# EAGLE design MySens-nRF52-V01-008 (EAGLE 9.1.0)
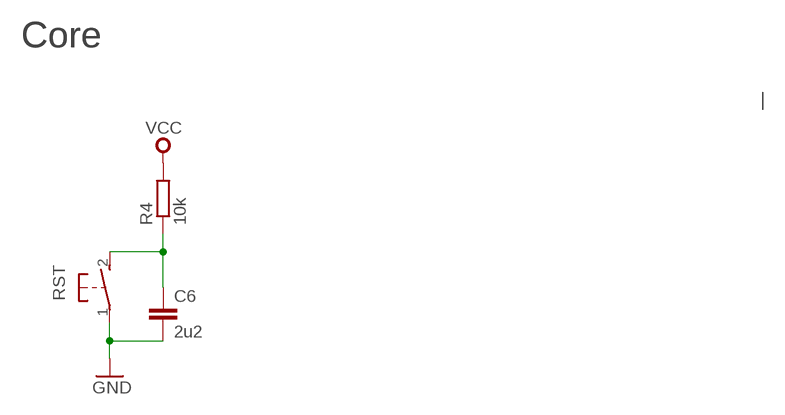
[diagram p0: schematic, sheet 1, part 1 of 2]
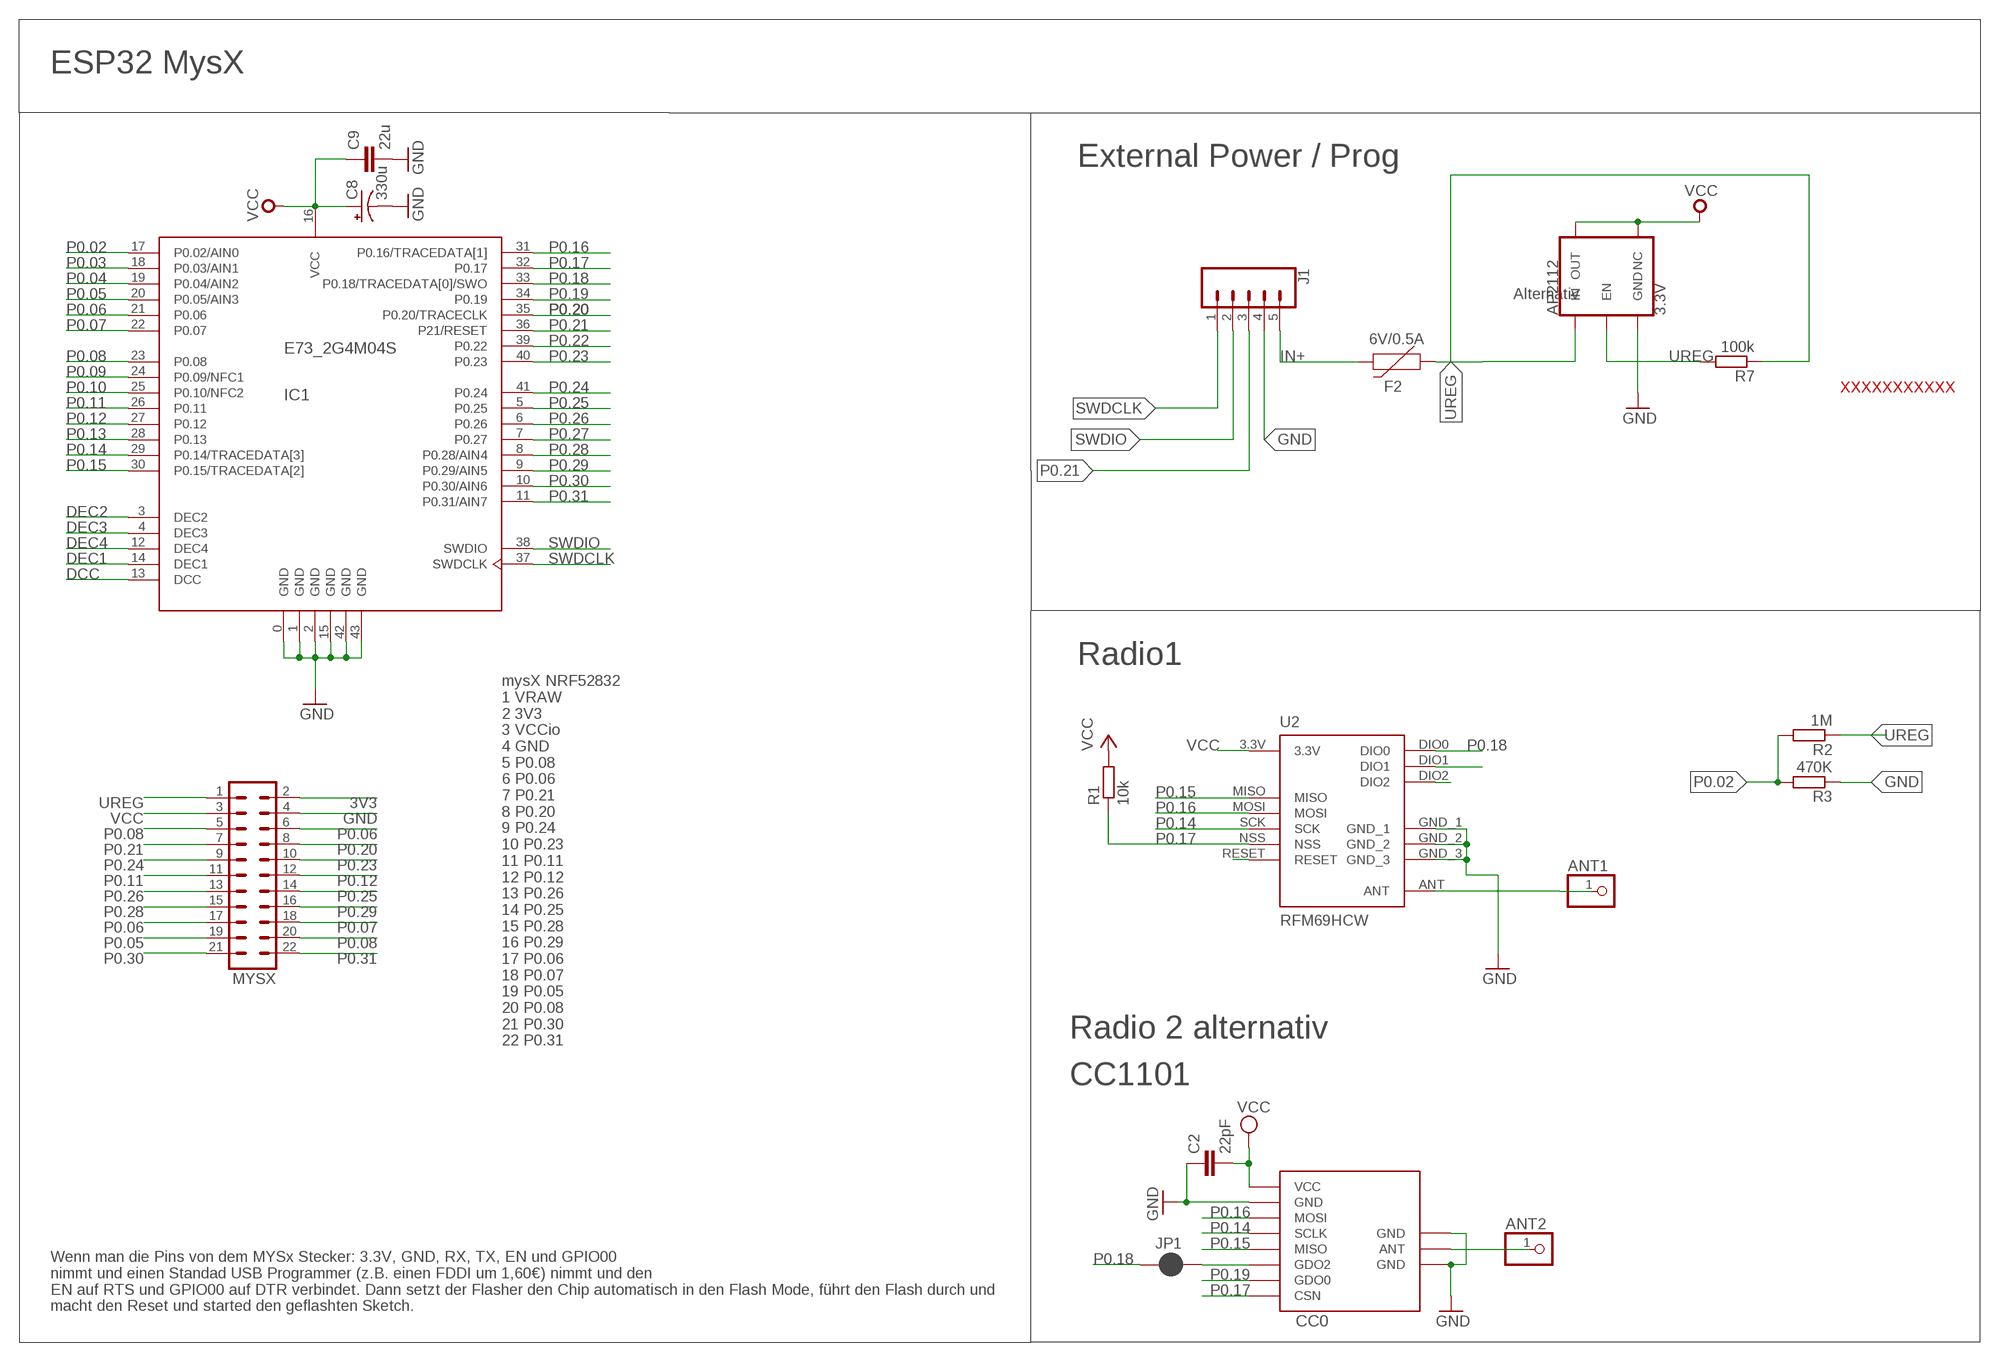
[diagram p1: schematic, sheet 1, part 2 of 2]

## Parts
ANT1  PINHD-1X1  [1X01]
ANT2  PINHD-1X1  [1X01]
AP2112  3.3V  V_REG_AP2112K-3.3V  [SOT23-5]
C2  22pF  C-EUC0805  [C0805]
C6  2u2  C-EUC0805  [C0805]
C8  330u  CAP_POLSMD  [VISHAY_C]
C9  22u  C-EUC0805  [C0805]
CC0  CC1101  CC1101_MODULE1SMD  [CC1101_MODULE1_SMD]
F2  6V/0.5A  PPTC_HALF-AMP  [1206]
IC1  E73_2G4M04S  [E73_2G4M04S]
J1  CONN_05LOCK  [1X05_LOCK]
JP1  JUMPER-SMT_2_NC_PASTE_NO-SILK  [SMT-JUMPER_2_NC_PASTE_NO-SILK]
MYSX  MA11-2  [MA11-2]
R1  10k  R-EU_M0805  [M0805]
R2  1M  R-EU_M0805  [M0805]
R3  470K  R-EU_M0805  [M0805]
R4  10k  R-EU_M0805  [M0805]
R7  100k  R-EU_M0805  [M0805]
RST  DTSM-3  [DTSM-3]
U2  RFM69HCW  [RFM69HCW-XXXS2]

## Nets
3V3: MYSX.2
ANT0: ANT2.1 CC0.ANT
ANT1: ANT1.1 U2.ANT
DCC: IC1.13(DCC)
DEC1: IC1.14(DEC1)
DEC2: IC1.3(DEC2)
DEC3: IC1.4(DEC3)
DEC4: IC1.12(DEC4)
GND [gnd]: AP2112.2(GND) C2.1 C6.2 C8.- C9.2 CC0.GND@0(GND) CC0.GND@1(GND) CC0.GND@2(GND) IC1.0(GND) IC1.1(GND) IC1.2(GND) IC1.15(GND) IC1.42(GND) IC1.43(GND) J1.4 MYSX.4 R3.1 RST.1 U2.GND_1 U2.GND_2 U2.GND_3
IN+ [vcc]: F2.2 J1.5
MAYBE_IO5: CC0.GDO2 JP1.2
N$1: AP2112.3(EN) R7.2
N$2: C6.1 R4.1 RST.2
N$4: U2.DIO2
N$8: U2.DIO1
N$9: U2.RESET
P0.02: IC1.17(P0.02/AIN0) R2.2 R3.2
P0.03: IC1.18(P0.03/AIN1)
P0.04: IC1.19(P0.04/AIN2)
P0.05: IC1.20(P0.05/AIN3) MYSX.19
P0.06: IC1.21(P0.06) MYSX.6 MYSX.17
P0.07: IC1.22(P0.07) MYSX.18
P0.08: IC1.23(P0.08) MYSX.5 MYSX.20
P0.09: IC1.24(P0.09/NFC1)
P0.10: IC1.25(P0.10/NFC2)
P0.11: IC1.26(P0.11) MYSX.11
P0.12: IC1.27(P0.12) MYSX.12
P0.13: IC1.28(P0.13)
P0.14: CC0.SCLK IC1.29(P0.14/TRACEDATA[3]) U2.SCK
P0.15: CC0.MISO IC1.30(P0.15/TRACEDATA[2]) U2.MISO
P0.16: CC0.MOSI IC1.31(P0.16/TRACEDATA[1]) U2.MOSI
P0.17: CC0.CSN IC1.32(P0.17) R1.1 U2.NSS
P0.18: IC1.33(P0.18/TRACEDATA[0]/SWO) JP1.1 U2.DIO0
P0.19: CC0.GDO0 IC1.34(P0.19)
P0.20: IC1.35(P0.20/TRACECLK) MYSX.8
P0.21: IC1.36(P21/RESET) J1.3 MYSX.7
P0.22: IC1.39(P0.22)
P0.23: IC1.40(P0.23) MYSX.10
P0.24: IC1.41(P0.24) MYSX.9
P0.25: IC1.5(P0.25) MYSX.14
P0.26: IC1.6(P0.26) MYSX.13
P0.27: IC1.7(P0.27)
P0.28: IC1.8(P0.28/AIN4) MYSX.15
P0.29: IC1.9(P0.29/AIN5) MYSX.16
P0.30: IC1.10(P0.30/AIN6) MYSX.21
P0.31: IC1.11(P0.31/AIN7) MYSX.22
SWDCLK: IC1.37(SWDCLK) J1.1
SWDIO: IC1.38(SWDIO) J1.2
UREG [gnd]: AP2112.1(IN) F2.1 MYSX.1 R2.1 R7.1
VCC [gnd]: AP2112.4(NC) AP2112.5(OUT) C2.2 C8.+ C9.1 CC0.VCC IC1.16(VCC) MYSX.3 R1.2 R4.2 U2.3.3V

## Notes on the sheet
- Core | Core
- ESP32 MysX
- External Power / Prog
- Alternativ
- XXXXXXXXXXX
- Radio1
- Radio 2 alternativ
- mysX NRF52832
  1 VRAW
  2 3V3
  3 VCCio
  4 GND
  5 P0.08
  6 P0.06
  7 P0.21
  8 P0.20
  9 P0.24
  10 P0.23
  11 P0.11
  12 P0.12
  13 P0.26
  14 P0.25
  15 P0.28
  16 P0.29
  17 P0.06
  18 P0.07
  19 P0.05
  20 P0.08
  21 P0.30
  22 P0.31
- CC1101
- Wenn man die Pins von dem MYSx Stecker: 3.3V, GND, RX, TX, EN und GPIO00
  nimmt und einen Standad USB Programmer (z.B. einen FDDI um 1,60€) nimmt und den
  EN auf RTS und GPIO00 auf DTR verbindet. Dann setzt der Flasher den Chip automatisch in den Flash Mode, führt den Flash durch und
  macht den Reset und started den geflashten Sketch.

## Library data of the parts
ANT1 ANT2 = pinhead:PINHD-1X1: PIN HEADER
AP2112 = SparkFun-IC-Power:V_REG_AP2112: AP2112 - 600mA CMOS LDO Regulator w/ Enable The AP2112 is CMOS process low dropout linear regulator with enable function, the regulator delivers a guaranteed 600mA (min.) continuous load current. Features Output Voltage Accuracy: ±1.5% Output Current: 600mA (Min.) Foldback Short Current Protection: 50mA Enable Function to Turn ON/OFF VOUT Low Dropout Voltage (3.3V): 250mV (Typ.) @IOUT=600mA Excellent Load Regulation: 0.2%/A (Typ.) Excellent Line Regulation: 0.02%/V (Typ.) Low Quiescent Current: 55μA (Typ.) Low Standby Current: 0.01μA (Typ.) Low Output Noise: 50μVRMS PSRR: 100Hz -65dB, 1kHz -65dB OTSD Protection Stable with 1.0μF Flexible Cap: Ceramic, Tantalum and Aluminum Electrolytic Operation Temperature Range: -40°C to 85°C ESD: MM 400V, HBM 4000V; PROD_ID: VREG-12457
C2 = rcl:C-EU: CAPACITOR, European symbol; SPICEPREFIX: C
C6 C9 = rcl@1:C-EU: CAPACITOR, European symbol; SPICEPREFIX: C
C8 = SparkFun-Passives:CAP_POL: Capacitor Polarized These are standard SMD and PTH capacitors. Normally 10uF, 47uF, and 100uF in electrolytic and tantalum varieties. Always verify the external diameter of the through hole cap, it varies with capacity, voltage, and manufacturer. The EIA devices should be standard.
CC0 = wireless:CC1101_MODULE1: CC1101 wireless module for 433/868 MHz (sold from Aliexpress). DIL version for mounting with pin header (and SMD soldering) and SMD only variant available.
F2 = SparkFun-Fuses:PPTC: Resettable Fuse PPTC Resettable Fuse. Really a sort of resistor with a polymeric positive temperature coefficient whose resistance increases dramatically with an increase in temperature. When heated by the power passing through the resistance rises causing the current to be limited, protecting the circuit. This is achieved by the transition of the polymer from a crystalline to an amorphous state where the conductive carbon separates breaking the conductive pathways found in the cool crystalline structure. When a PPTC cools back down it resumes conducting letting the circuit turn back on. SparkFun Products: SparkFun RedBoard - Programmed with Arduino <https://www.sparkfun.com/products/12757> Pro Micro - 5V/16MHz <https://www.sparkfun.com/products/12640> Arduino Pro 328 - 5V/16MHz <https://www.sparkfun.com/products/10915> MP3 Trigger <https://www.sparkfun.com/products/13720>; PROD_ID: RES-08585
IC1 = E73-2G4M04S:E73_2G4M04S: E73-2G4M04S nRF52832 based BLE module
J1 = SparkFun-Connectors:CONN_05: Multi connection point. Often used as Generic Header-pin footprint for 0.1 inch spaced/style header connections On any of the 0.1 inch spaced packages, you can populate with these: Break Away Headers - Straight <https://www.sparkfun.com/products/116> (PRT-00116) Break Away Male Headers - Right Angle <https://www.sparkfun.com/products/553> (PRT-00553) Female Headers <https://www.sparkfun.com/products/115> (PRT-00115) Break Away Headers - Machine Pin <https://www.sparkfun.com/products/117> (PRT-00117) Break Away Female Headers - Swiss Machine Pin <https://www.sparkfun.com/products/743> (PRT-00743) For SCREWTERMINALS and SPRING TERMINALS visit here: Screw Terimnals on SparkFun.com <https://www.sparkfun.com/search/results?term=Screw+Terminals> (5mm/3.5mm/2.54mm spacing) This device is also useful as a general connection point to wire up your design to another part of your project. Our various solder wires solder well into these plated through hole pads. Hook-Up Wire - Assortment (Stranded, 22 AWG) <https://www.sparkfun.com/products/11375> (PRT-11375) Hook-Up Wire - Assortment (Solid Core, 22 AWG) <https://www.sparkfun.com/products/11367> (PRT-11367) View the entire wire category on our website here <https://www.sparkfun.com/categories/141> Special notes: Molex polarized connector foot print use with SKU : PRT-08231 with associated crimp pins and housings. 1MM SMD Version SKU: PRT-10208
JP1 = SparkFun-Jumpers:JUMPER-SMT_2_NC_PASTE: Normally closed solder jumper This jumper has an aperture in the stencil to allow solder paste to bridge the split in the wire so it's normally closed (NC). Wick off the solder to open the connection. Reapply solder to reclose the connection.
MYSX = con-Pinheader:MA11-2: PIN HEADER; OC_FARNELL: unknown; OC_NEWARK: unknown
R1-R3 R7 = rcl:R-EU_: RESISTOR, European symbol; SPICEPREFIX: R
R4 = rcl@1:R-EU_: RESISTOR, European symbol; SPICEPREFIX: R
RST = switch-tact:DTSM-3
U2 = doug:RFM69H

## Net classes
0 default: width 0.305 mm, clearance 0.205 mm
1 gnd: width 0.457 mm, drill 0.635 mm, clearance 0.254 mm
2 vcc: width 0.406 mm, drill 0.406 mm, clearance 0.254 mm

## Board
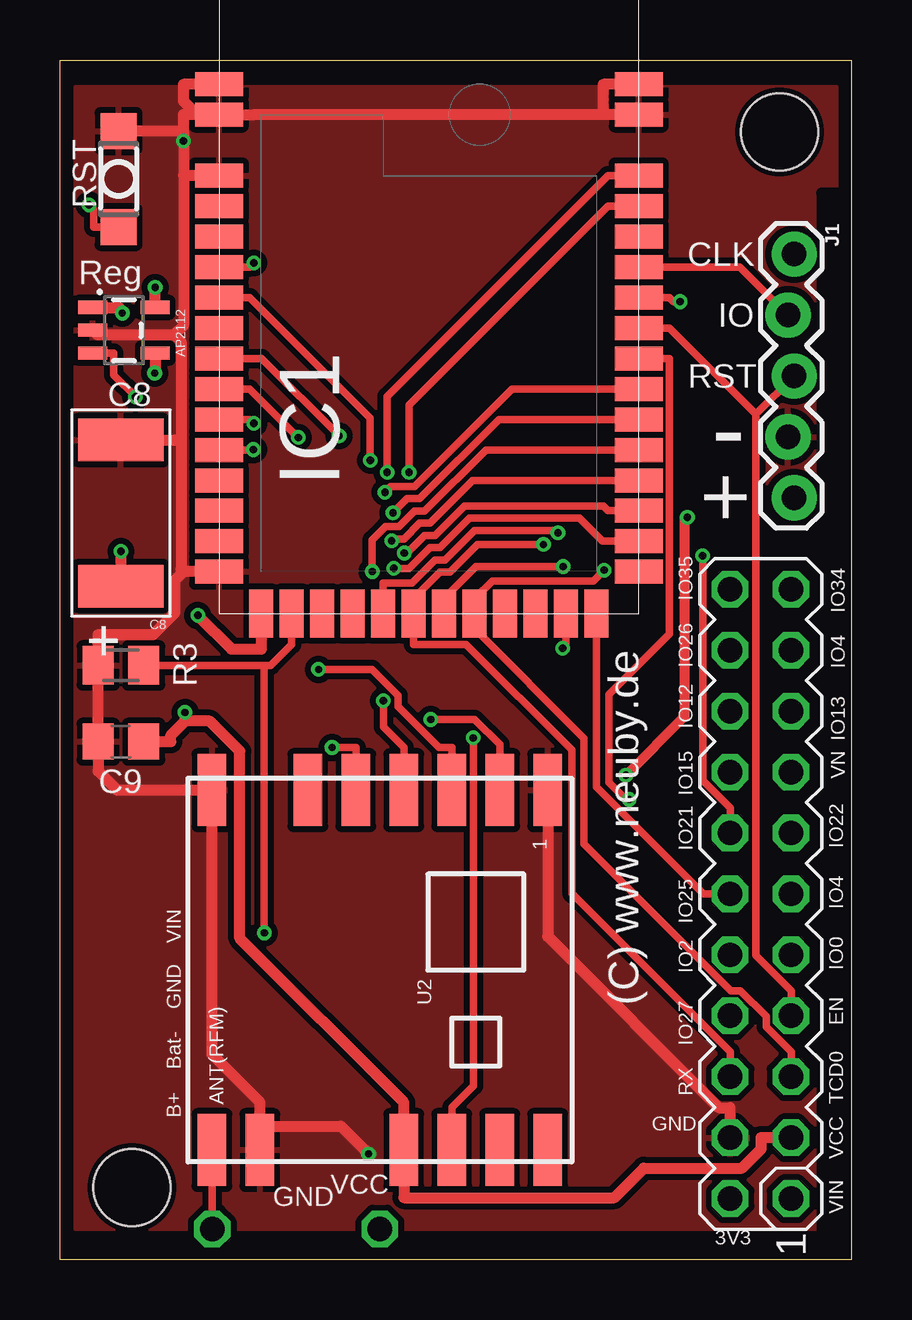
[diagram p2: board, top side]
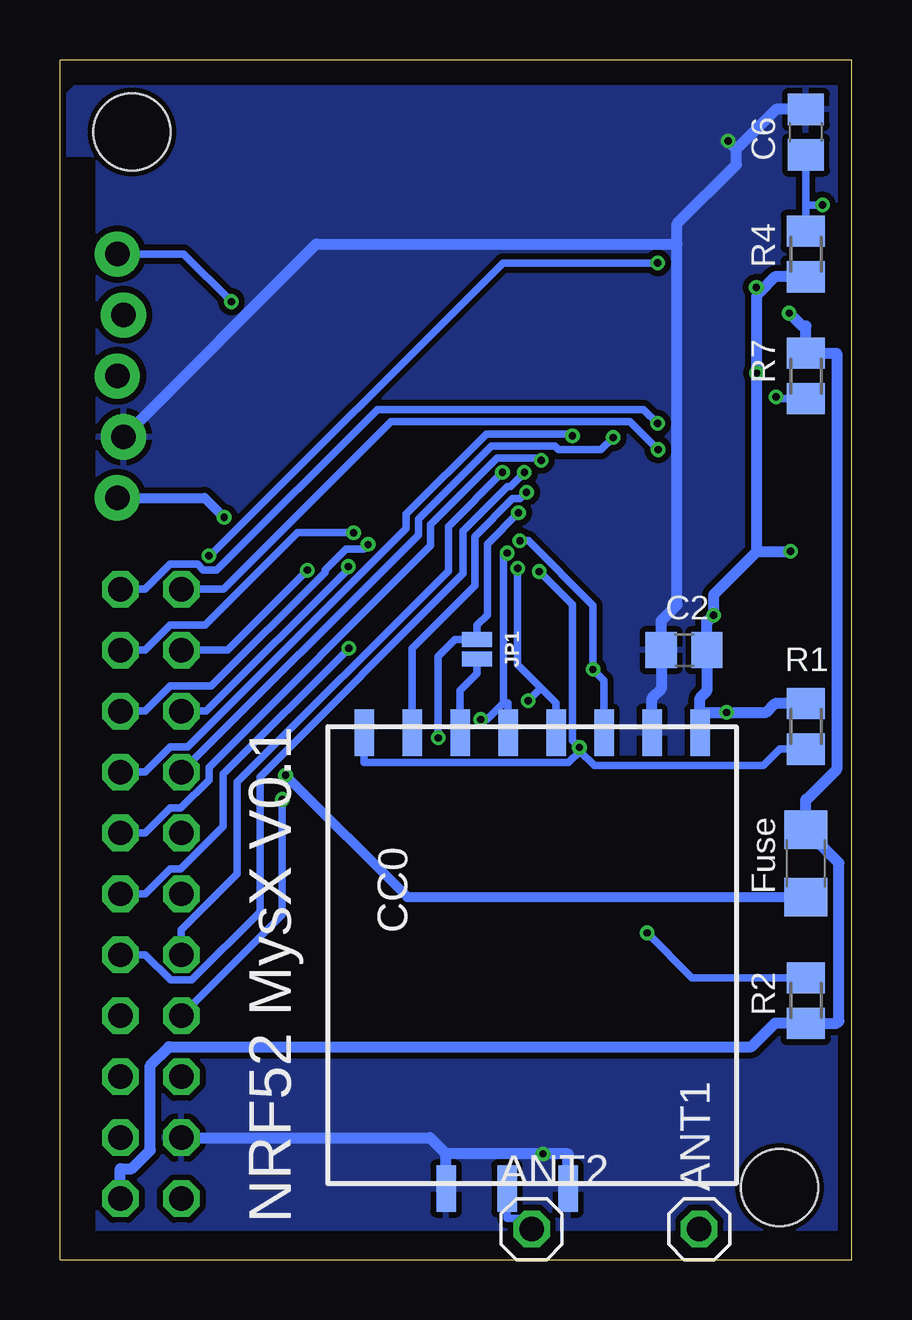
[diagram p3: board, bottom side, seen from below]

Size 33 x 50 mm. Coordinates in mm from the lower left corner, seen from the top.
Outline: 0,0 0,50 33,50 33,0 0,0
Copper layers (1*16): Top 0.035mm / dielectric 1.5mm / Bottom 0.035mm
Design rules "dirt_cheap_dirty_boards.v1": minimum track width 5mil, minimum drill 12mil, track to track 5mil, track to pad 5mil, pad to pad 5mil, via to via 5mil, smd to smd 0mil, copper to edge 10mil, drill to drill 10mil, minimum pad ring 10mil, minimum via ring 6mil, stop-mask expansion 2mil, vias tented up to drill 25mil, thermal gap 10mil
Holes 3.2 mm at 3,3 30,47
tRestrict: area 31.8,0.6 to 33,44.5
bRestrict: area 31.8,1.3 to 33,45.7

### Footprints (pad centres in the part's own frame; a part is rotated, then mirrored left to right if it is on the bottom)
1X01 = drill 1.016 octagon: 1 0,0
SOT23-5 = smd 0.55 x 1.2: 1 -0.95,-1.3; 2 0,-1.3; 3 0.95,-1.3; 4 0.95,1.3; 5 -0.95,1.3
C0805 = smd 1.3 x 1.5: 1 -0.95,0; 2 0.95,0
VISHAY_C = smd 3.556 x 1.778: + 0,3.048; - 0,-3.048
CC1101_MODULE1_SMD = smd 1.93 x 0.813: ANT 19,5.96; CSN 0,0; GDO0 0,2; GDO2 0,4; GND@0 0,12; GND@1 19,8.5; GND@2 19,3.42; MISO 0,6; MOSI 0,10; SCLK 0,8; VCC 0,14
1206 = smd 1.6 x 1.8: 1 -1.4,0; 2 1.4,0
E73_2G4M04S = smd 1 x 2: 0 22.065,17.5; 1 20.795,17.5; 2 18.255,17.5; 3 16.985,17.5; 4 15.715,17.5; 5 14.445,17.5; 6 13.175,17.5; 7 11.905,17.5; 8 10.635,17.5; 9 9.365,17.5; 10 8.095,17.5; 11 6.825,17.5; 12 5.555,17.5; 13 4.285,17.5; 14 3.015,17.5; 15 1.745,17.5; 28 1.745,0; 29 3.015,0; 30 4.285,0; 31 5.555,0; 32 6.825,0; 33 8.095,0; 34 9.365,0; 35 10.635,0; 36 11.905,0; 37 13.175,0; 38 14.445,0; 39 15.715,0; 40 16.985,0; 41 18.255,0; 42 20.795,0; 43 22.065,0 | smd 2 x 1: 16 0,15.735; 17 0,14.465; 18 0,13.195; 19 0,11.925; 20 0,10.655; 21 0,9.385; 22 0,8.115; 23 0,6.845; 24 0,5.575; 25 0,4.305; 26 0,3.035; 27 0,1.765
1X05_LOCK = drill 1.016 pad 1.88: 1 0,0.127; 2 2.54,-0.127; 3 5.08,0.127; 4 7.62,-0.127; 5 10.16,0.127
SMT-JUMPER_2_NC_PASTE_NO-SILK = smd 0.635 x 1.27: 1 -0.406,0; 2 0.406,0
MA11-2 = drill 1.016 octagon: 1 -12.7,-1.27; 2 -12.7,1.27; 3 -10.16,-1.27; 4 -10.16,1.27; 5 -7.62,-1.27; 6 -7.62,1.27; 7 -5.08,-1.27; 8 -5.08,1.27; 9 -2.54,-1.27; 10 -2.54,1.27; 11 0,-1.27; 12 0,1.27; 13 2.54,-1.27; 14 2.54,1.27; 15 5.08,-1.27; 16 5.08,1.27; 17 7.62,-1.27; 18 7.62,1.27; 19 10.16,-1.27; 20 10.16,1.27; 21 12.7,-1.27; 22 12.7,1.27
M0805 = smd 1.3 x 1.6: 1 -0.95,0; 2 0.95,0
DTSM-3 = smd 1.5 x 1.5: 1 -2,0; 2 2,0
RFM69HCW-XXXS2 = smd 3 x 1.2: 3.3V 7.5,1; ANT 7.5,-7; DIO0 7.5,3; DIO1 7.5,5; DIO2 7.5,7; GND_1 7.5,-5; GND_2 -7.5,-7; GND_3 -7.5,7; MISO -7.5,5; MOSI -7.5,3; NSS -7.5,-1; RESET -7.5,-3; SCK -7.5,1

### Placement (x,y rotation side)
ANT1  6.35,1.27 0 bottom
ANT2  13.34,1.27 0 bottom
AP2112  2.67,38.73 270 top
C2  6.99,25.4 0 bottom
C6  1.91,46.99 90 bottom
C8  2.54,31.11 180 top
C9  2.54,21.59 180 top
CC0  20.32,21.95 270 bottom
F2  1.91,16.51 270 bottom
IC1  24.13,26.92 90 top
J1  30.48,41.91 270 top
JP1  15.62,25.43 270 bottom
MYSX  29.21,15.24 90 top
R1  1.91,22.23 90 bottom
R2  1.91,10.79 90 bottom
R3  2.54,24.77 0 top
R4  1.91,41.91 270 bottom
R7  1.91,36.83 270 bottom
RST  2.44,45.04 270 top
U2  13.34,12.06 270 top

### Tracks (layer width: path | path; a pad name or v marks a point on that pad's centre or on a via)
ANT0
  Bottom 0.305: CC0.ANT 14.36,1.71 13.78,1.71 ANT2.1
ANT1
  Top 0.305: ANT1.1 6.35,2.31 6.33,2.33 U2.ANT
GND  (via drill 0.3 pad 0.61)
  Top 0.457: 5.15,45.18 | 5.15,45.18 5.15,38.92 4.77,38.55 | 4.77,38.55 5.05,38.27 5.05,34.16 | AP2112.2 1.56,38.55 4.77,38.55 | 5.15,45.18 v5.15,46.62 5.15,47.04 | 5.05,34.16 5.05,28.77 5.15,28.67 | 5.05,34.16 4.8,34.16 C8.- | 5.15,28.67 4.8,28.32 4.8,26.97 3.88,26.05 1.59,26.05 R3.1 C9.2 1.59,20.36 2.38,19.57 U2.GND_2 6.33,8.55 8.34,6.55 8.34,5.56 | IC1.15 5.15,28.67 | MYSX.4 27.94,6.33 27.47,6.33 20.34,13.46 U2.GND_3 | IC1.43 22.65,48.99 22.65,47.72 | 22.65,47.72 8.11,47.72 IC1.1 5.89,47.72 | IC1.0 5.15,48.99 5.15,48.28 5.71,47.72 5.89,47.72 | 5.89,47.72 5.15,47.72 5.15,47.04 | IC1.2 5.15,45.18 | 5.15,47.04 RST.1 | IC1.42 22.65,47.72 | 8.34,5.56 11.71,5.56 v12.87,4.4 | U2.GND_1 8.34,5.56
  Bottom 0.457: J1.4 22.31,42.33 7.28,42.33 | 16.9,4.4 v12.87,4.4 11.82,4.4 CC0.GND@1 | CC0.GND@2 16.9,4.4 | MYSX.4 17.58,5.08 16.9,4.4 | 7.28,42.33 7.28,43.17 4.8,45.65 4.8,46.28 | 4.8,46.28 | 7.28,42.33 7.28,27.29 7.93,26.63 C2.1 7.93,23.79 8.32,23.4 CC0.GND@0 | 4.8,46.28 v5.15,46.62 | 4.8,46.28 3.14,47.94 C6.2
  pour Top: 0.64,1.27 0.64,48.9 32.38,48.9 32.38,1.27
  pour Bottom: 0.64,1.27 0.64,48.9 32.38,48.9 33.02,48.26 33.02,1.27
IN+  (via drill 0.3 pad 0.61)
  Top 0.406: v26.15,30.93 26.03,30.81 26.03,22.62 v23.59,20.19
  Bottom 0.406: J1.5 26.97,31.75 v26.15,30.93 | v23.59,20.19 18.52,15.11 F2.2
MAYBE_IO5
  Bottom 0.305: JP1.2 15.62,24.43 16.32,23.73 CC0.GDO2
N$1  (via drill 0.3 pad 0.61)
  Top 0.305: AP2112.3 2.25,37.78 2.25,36.86 v3.15,35.96
  Bottom 0.305: R7.2 3.07,35.88 v3.15,35.96
N$2  (via drill 0.3 pad 0.61)
  Top 0.305: RST.2 1.42,43.04 1.42,43.76 v1.21,43.96
  Bottom 0.305: 1.91,43.96 C6.1 | R4.1 1.91,43.96 | v1.21,43.96 1.91,43.96
P0.02  (via drill 0.3 pad 0.61)
  Top 0.305: 8.52,24.77 8.79,24.77 9.66,25.64 IC1.17 | R3.2 8.52,24.77 | v8.52,13.62 8.52,24.77
  Bottom 0.305: R2.2 6.65,11.74 v8.52,13.62
P0.05  (via drill 0.3 pad 0.61)
  Top 0.305: v20.76,30.29 20.66,30.39 17.28,30.39 16.05,29.16 15.63,29.16 14.67,28.2 13.47,28.2 IC1.20
  Bottom 0.305: v20.76,30.29 23.1,30.29 26.95,26.44 28.4,26.44 29.44,25.4 MYSX.19
P0.06  (via drill 0.3 pad 0.61)
  Top 0.305: v20.16,29.8 17.41,29.8 16.26,28.65 15.85,28.65 14.74,27.55 IC1.21 14.74,25.64 16.93,25.64 21.34,21.23 21.34,15.26 27.94,8.66 MYSX.6
  Bottom 0.305: v20.16,29.8 20.35,29.61 21.07,29.61 21.95,28.73 21.95,28.64 26.69,23.9 28.4,23.9 29.44,22.86 MYSX.17
P0.07  (via drill 0.3 pad 0.61)
  Top 0.305: v20.97,28.89 17.35,28.89 16.02,27.55 IC1.22
  Bottom 0.305: v20.97,28.89 20.97,28.79 26.9,22.86 MYSX.18
P0.08  (via drill 0.3 pad 0.61)
  Top 0.305: v22.68,28.74 22.23,28.29 18.02,28.29 17.29,27.55 IC1.23 17.29,26.3 21.85,21.73 21.85,17.31 27.96,11.2 28.37,11.2 29.44,10.14 29.44,9.7 30.48,8.66 MYSX.5
  Bottom 0.305: MYSX.20 26.02,25.4 v22.68,28.74
P0.11  (via drill 0.3 pad 0.61)
  Top 0.305: v20.96,25.48 21.09,25.61 21.09,25.64 IC1.26
  Bottom 0.305: v20.96,25.48 26.2,20.24 26.2,18.05 27.96,16.28 28.4,16.28 29.44,15.24 MYSX.11
P0.12
  Top 0.305: MYSX.12 26.81,15.24 22.36,19.69 IC1.27
P0.14  (via drill 0.3 pad 0.61)
  Top 0.305: v13.92,28.81 14.55,28.81 15.42,29.67 15.84,29.67 17.07,30.9 21.65,30.9 22.61,29.94 IC1.29 | U2.SCK 14.34,21.34 13.48,22.2 v13.48,23.29
  Bottom 0.305: 12.95,23.83 13.92,24.8 v13.92,28.81 | v13.48,23.29 12.95,23.83 | 12.95,23.83 12.32,23.2 CC0.SCLK | 12.95,23.83
P0.15  (via drill 0.3 pad 0.61)
  Top 0.305: v14.36,29.45 14.47,29.45 15.21,30.18 15.63,30.18 16.86,31.41 22.65,31.41 22.85,31.21 IC1.30 | U2.MISO 18.34,21.47 17.29,22.51 v15.46,22.51
  Bottom 0.305: v14.36,29.45 14.51,29.3 14.51,23.2 | 14.51,23.2 14.32,23.2 CC0.MISO | v15.46,22.51 15.19,22.51 14.51,23.2
P0.16  (via drill 0.3 pad 0.61)
  Top 0.305: v13.83,29.96 13.9,30.03 14.34,30.03 15,30.69 15.42,30.69 17.2,32.48 IC1.31 | v10.78,24.6 13.01,24.6 14.1,23.51 14.1,23.04 15.8,21.34 16.34,21.34 U2.MOSI
  Bottom 0.305: v13.83,29.96 13.47,29.96 10.78,27.27 v10.78,24.6 10.32,24.14 CC0.MOSI
P0.17  (via drill 0.3 pad 0.61)
  Top 0.305: v13.02,28.68 13.02,29.98 13.58,30.54 14.13,30.54 14.79,31.2 15.21,31.2 17.75,33.75 IC1.32 | v11.34,21.34 12.34,21.34 U2.NSS
  Bottom 0.305: 11.32,21.18 11.34,21.2 v11.34,21.34 11.63,21.64 11.63,27.29 v13.02,28.68 | 11.32,21.18 10.72,20.58 3.68,20.58 2.98,21.27 R1.1 | 11.32,21.18 11.79,20.71 20.32,20.71 CC0.CSN
P0.18  (via drill 0.3 pad 0.61)
  Top 0.305: v13.88,31.13 14.47,31.71 15,31.71 18.3,35.02 IC1.33 | U2.DIO0 16.34,6.34 17.23,7.24 v17.23,21.74
  Bottom 0.305: v13.88,31.13 15.19,29.83 15.19,26.87 15.62,26.44 JP1.1 16.53,25.84 17.23,25.14 v17.23,21.74
P0.19  (via drill 0.3 pad 0.61)
  Top 0.305: v13.55,31.98 13.79,32.22 14.79,32.22 18.85,36.29 IC1.34
  Bottom 0.305: v13.55,31.98 13.82,31.71 14.13,31.71 15.7,30.14 15.7,28.1 18.32,25.48 CC0.GDO0
P0.20  (via drill 0.3 pad 0.61)
  Top 0.305: v23.73,19.18 23.6,19.18 22.88,19.89 22.88,23.55 25.41,26.07 25.41,37.56 IC1.35
  Bottom 0.305: v23.73,19.18 23.73,14.37 MYSX.8
P0.21
  Top 0.305: IC1.36 25.41,38.83 29.01,35.23 | 29.01,35.23 J1.3 | 29.01,35.23 29.01,12.68 30.48,11.2 MYSX.7
P0.23  (via drill 0.3 pad 0.61)
  Top 0.305: IC1.40 22.85,43.91 14.55,35.61 v14.55,32.81
  Bottom 0.305: MYSX.10 27.94,13.74 25.61,16.07 25.61,19.9 16.8,28.71 16.8,30.56 v14.55,32.81
P0.24  (via drill 0.3 pad 0.61)
  Top 0.305: v13.64,32.81 13.64,35.97 22.85,45.18 IC1.41
  Bottom 0.305: v13.64,32.81 14.22,32.22 14.34,32.22 16.2,30.36 16.2,28.59 24.67,20.12 24.67,14.5 27.51,11.66 28.4,11.66 29.44,12.7 MYSX.9
P0.25  (via drill 0.3 pad 0.61)
  Top 0.305: v26.8,29.34 26.8,19.96 27.94,18.82 MYSX.14 | v8.08,41.54 7.91,41.37 IC1.5
  Bottom 0.305: v26.8,29.34 26.73,29.34 14.53,41.54 v8.08,41.54
P0.26  (via drill 0.3 pad 0.61)
  Top 0.305: v12.94,33.32 12.94,35.07 7.91,40.1 IC1.6
  Bottom 0.305: v12.94,33.32 13.02,33.4 14.79,33.4 17.54,30.64 17.54,29.76 26.79,20.51 26.79,20 27.96,18.82 28.4,18.82 29.44,17.78 MYSX.13
P0.28  (via drill 0.3 pad 0.61)
  Top 0.305: IC1.8 8.41,37.56 v11.64,34.34
  Bottom 0.305: v11.64,34.34 11.72,34.42 15.23,34.42 18.56,31.08 18.56,30.47 27.67,21.36 28.4,21.36 29.44,20.32 MYSX.15
P0.29  (via drill 0.3 pad 0.61)
  Top 0.305: v9.94,34.26 7.91,36.29 IC1.9
  Bottom 0.305: MYSX.16 18.05,30.21 18.05,30.86 15.01,33.91 12.37,33.91 12.22,33.75 10.45,33.75 v9.94,34.26
P0.30  (via drill 0.3 pad 0.61)
  Top 0.305: v8.08,34.85 7.91,35.02 IC1.10
  Bottom 0.305: v8.08,34.85 8.67,35.44 19.77,35.44 26.46,28.75 27.03,28.75 27.27,28.98 28.4,28.98 29.44,27.94 MYSX.21
P0.31  (via drill 0.3 pad 0.61)
  Top 0.305: v8.07,33.76 7.92,33.76 7.91,33.75 IC1.11
  Bottom 0.305: v8.07,33.76 9.23,34.93 19.2,34.93 26.18,27.94 26.9,27.94 MYSX.22
SWDCLK  (via drill 0.3 pad 0.61)
  Top 0.305: IC1.37 25.41,40.1 25.58,39.92 v25.85,39.92
  Bottom 0.305: J1.1 27.84,41.91 v25.85,39.92
SWDIO
  Top 0.305: IC1.38 28.35,41.37 J1.2
UREG  (via drill 0.3 pad 0.61)
  Top 0.457: AP2112.1 2.45,39.69 2.45,39.6 v2.6,39.45
  Bottom 0.457: MYSX.1 30.48,3.79 30.01,3.79 29.23,4.56 29.23,8.09 28.46,8.87 4.17,8.87 3.19,9.85 R2.1 0.62,9.85 0.52,9.95 0.52,16.53 F2.1 1.91,19.19 1.85,19.19 0.62,20.42 0.62,37.78 R7.1 1.91,38.91 2.06,38.91 v2.6,39.45
VCC  (via drill 0.3 pad 0.61)
  Top 0.457: AP2112.4 3.97,36.97 v3.94,36.95 | v2.54,29.52 C8.+ | MYSX.3 29.23,5.08 29.23,4.61 28.43,3.81 24.34,3.81 23.11,2.58 14.34,2.58 U2.3.3V 14.34,4.91 14.34,6.55 7.49,13.39 7.49,21.2 6.25,22.44 5.21,22.44 | C9.1 4.62,21.59 4.62,21.85 5.21,22.44 | 5.21,22.44 v5.21,22.8 | IC1.16 8.39,25.44 7.15,25.44 v5.74,26.85 | AP2112.5 v3.97,40.52
  Bottom 0.457: v3.94,36.95 | v3.94,36.95 3.94,40.2 3.8,40.35 | 3.94,29.52 v3.94,36.95 | 3.94,29.52 v2.54,29.52 | 3.94,29.52 5.74,27.72 v5.74,26.85 5.96,26.63 6.04,26.63 C2.2 6.04,23.69 6.32,23.4 6.32,22.8 | 3.8,40.35 3.19,40.96 R4.2 | v3.97,40.52 3.8,40.35 | R1.2 3.19,23.18 3.56,22.8 v5.21,22.8 6.32,22.8 | CC0.VCC 6.32,22.8

### Text on the board
tNames: RST | Reg | CLK | IO | C8 | RST | - | + | IO35 | IO34 | IO26 | IO4 | (C) www.neuby.de | R3 | IO12 | IO13 | IO15 | VN | C9 | IO21 | IO22 | IO25 | VIN | IO4 | IO2 | GND | IO0 | ANT(RFM) | IO27 | Bat- | EN | RX | B+ | GND | TCD0 | VCC | VCC | GND | VIN | 3V3
bNames: C6 | R4 | R7 | C2 | R1 | Fuse | R2 | NRF52 MysX V0.1
Document: DS_1551K